# EAGLE design DevKit-V1 (EAGLE 9.6.2)

## Sheet 1 of 5
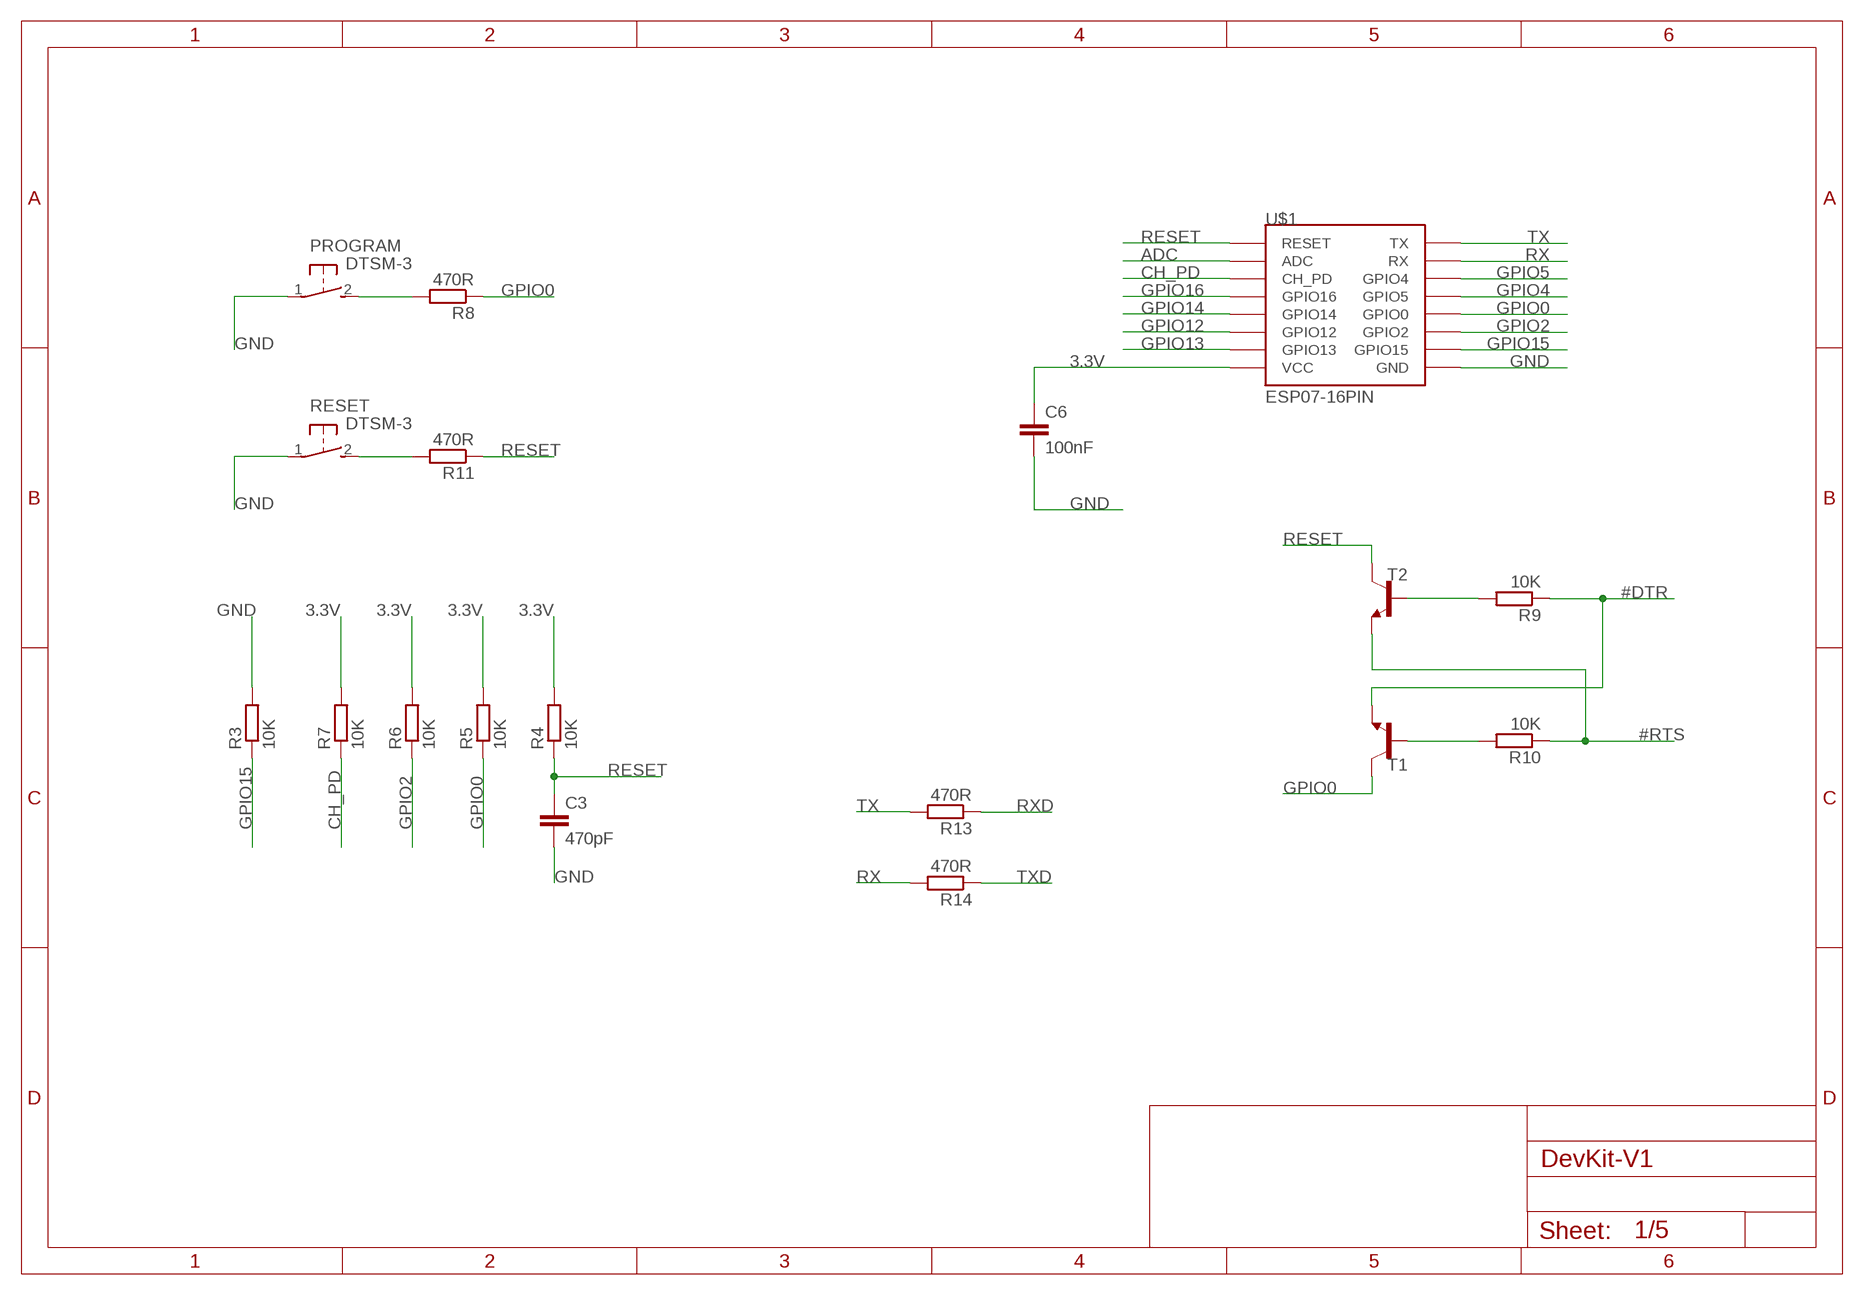
[diagram p0: schematic, sheet 1]

### Parts
C3  470pF  C-EUC0805  [C0805]
C6  100nF  C-EUC0805  [C0805]
PROGRAM  DTSM-3  [DTSM-3]
R3  10K  R-EU_R0805  [R0805]
R4  10K  R-EU_R0805  [R0805]
R5  10K  R-EU_R0805  [R0805]
R6  10K  R-EU_R0805  [R0805]
R7  10K  R-EU_R0805  [R0805]
R8  470R  R-EU_R0805  [R0805]
R9  10K  R-EU_R0805  [R0805]
R10  10K  R-EU_R0805  [R0805]
R11  470R  R-EU_R0805  [R0805]
R13  470R  R-EU_R0805  [R0805]
R14  470R  R-EU_R0805  [R0805]
RESET  DTSM-3  [DTSM-3]
T1  -NPN-SOT23-EBC  [SOT23-EBC]
T2  -NPN-SOT23-EBC  [SOT23-EBC]
U$1  ESP07-16PIN  [ESP07-16PIN]

### Nets
3.3V: C6.1 R4.2 R5.2 R6.2 R7.2 U$1.VCC ; also sheet 2,3,4
#DTR: R9.1 T1.E ; also sheet 2
#RTS: R10.1 T2.E ; also sheet 2
ADC: U$1.ADC
CH_PD: R7.1 U$1.CH_PD
GND: C3.2 C6.2 PROGRAM.1 R3.2 RESET.1 U$1.GND ; also sheet 2,3,4,5
GPIO0: R5.1 R8.1 T1.C U$1.GPIO0
GPIO2: R6.1 U$1.GPIO2
GPIO4: U$1.GPIO5 ; also sheet 5
GPIO5: U$1.GPIO4 ; also sheet 5
GPIO12: U$1.GPIO12 ; also sheet 4
GPIO13: U$1.GPIO13 ; also sheet 4
GPIO14: U$1.GPIO14 ; also sheet 4
GPIO15: R3.1 U$1.GPIO15 ; also sheet 4
GPIO16: U$1.GPIO16
N$1: PROGRAM.2 R8.2
N$2: R11.2 RESET.2
N$8: R10.2 T1.B
N$11: R9.2 T2.B
RESET: C3.1 R4.1 R11.1 T2.C U$1.REST(RESET)
RX: R14.2 U$1.RX
RXD: R13.1 ; also sheet 2
TX: R13.2 U$1.TX
TXD: R14.1 ; also sheet 2

## Sheet 2 of 5
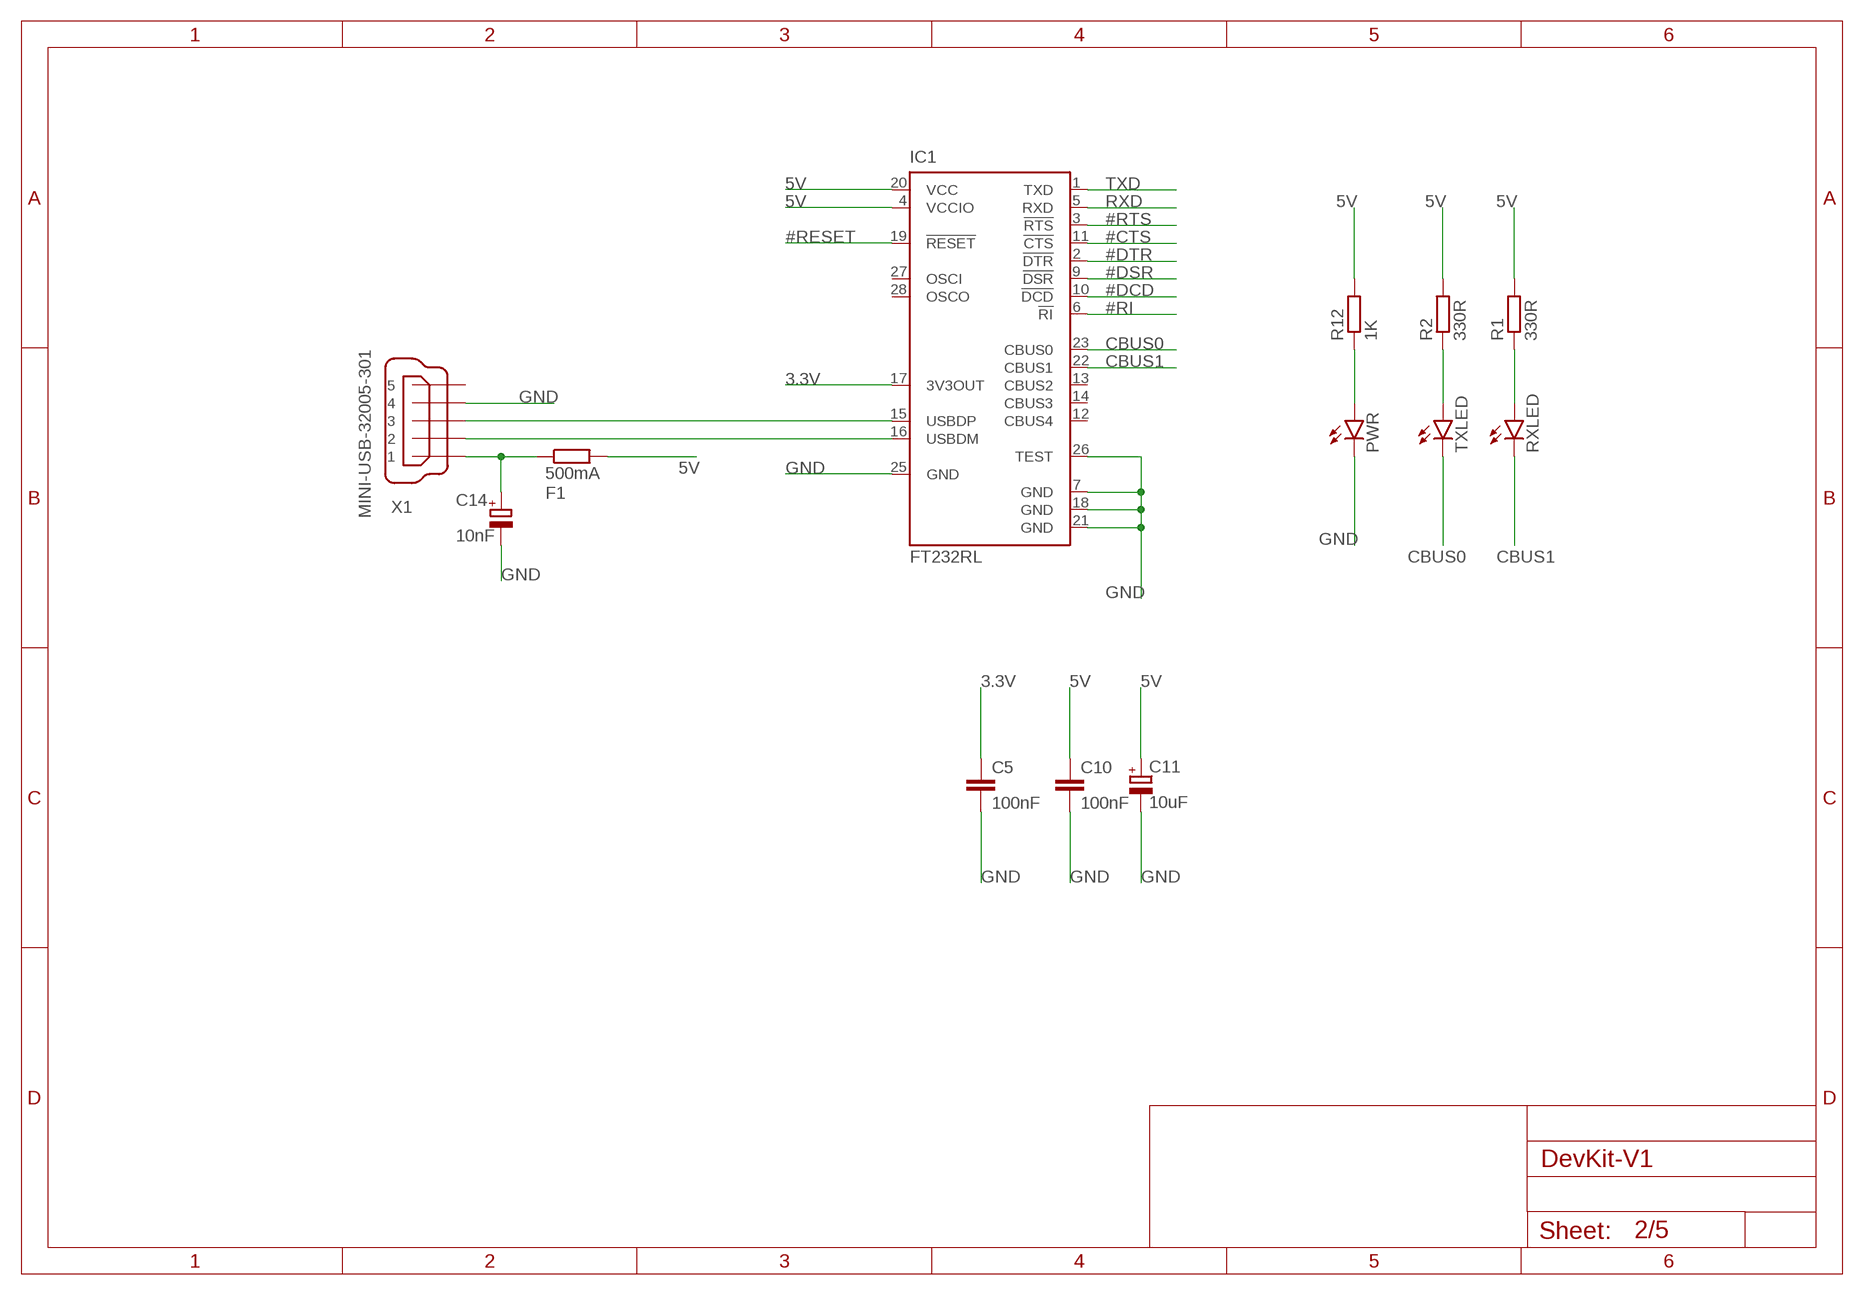
[diagram p1: schematic, sheet 2]

### Parts
C5  100nF  C-EUC0805  [C0805]
C10  100nF  C-EUC0805  [C0805]
C11  10uF  CPOL-EUSMCA  [SMC_A]
C14  10nF  CPOL-EUSMCA  [SMC_A]
F1  500mA  R-EU_R0805  [R0805]
IC1  FT232RL  [SSOP28]
PWR  LEDCHIP-LED0805  [CHIP-LED0805]
R1  330R  R-EU_R0805  [R0805]
R2  330R  R-EU_R0805  [R0805]
R12  1K  R-EU_R0805  [R0805]
RXLED  LEDCHIP-LED0805  [CHIP-LED0805]
TXLED  LEDCHIP-LED0805  [CHIP-LED0805]
X1  MINI-USB-32005-301  [32005-301]

### Nets
3.3V: C5.1 IC1.17(3V3OUT) ; also sheet 1,3,4
5V: C10.1 C11.+ F1.2 IC1.4(VCCIO) IC1.20(VCC) R1.2 R2.2 R12.2 ; also sheet 3,5
#CTS: IC1.11(!CTS)
#DCD: IC1.10(!DCD)
#DSR: IC1.9(!DSR)
#DTR: IC1.2(!DTR) ; also sheet 1
#RESET: IC1.19(!RESET)
#RI: IC1.6(!RI)
#RTS: IC1.3(!RTS) ; also sheet 1
CBUS0: IC1.23(CBUS0) TXLED.C
CBUS1: IC1.22(CBUS1) RXLED.C
GND: C5.2 C10.2 C11.- C14.- IC1.7(GND) IC1.18(GND) IC1.21(GND) IC1.25(GND) IC1.26(TEST) PWR.C X1.4 ; also sheet 1,3,4,5
N$6: IC1.15(USBDP) X1.3
N$7: IC1.16(USBDM) X1.2
N$10: C14.+ F1.1 X1.1
N$15: R1.1 RXLED.A
N$16: R2.1 TXLED.A
N$20: PWR.A R12.1
RXD: IC1.5(RXD) ; also sheet 1
TXD: IC1.1(TXD) ; also sheet 1
Unconnected: IC1.12(CBUS4) IC1.13(CBUS2) IC1.14(CBUS3) IC1.27(OSCI) IC1.28(OSCO) X1.5

## Sheet 3 of 5
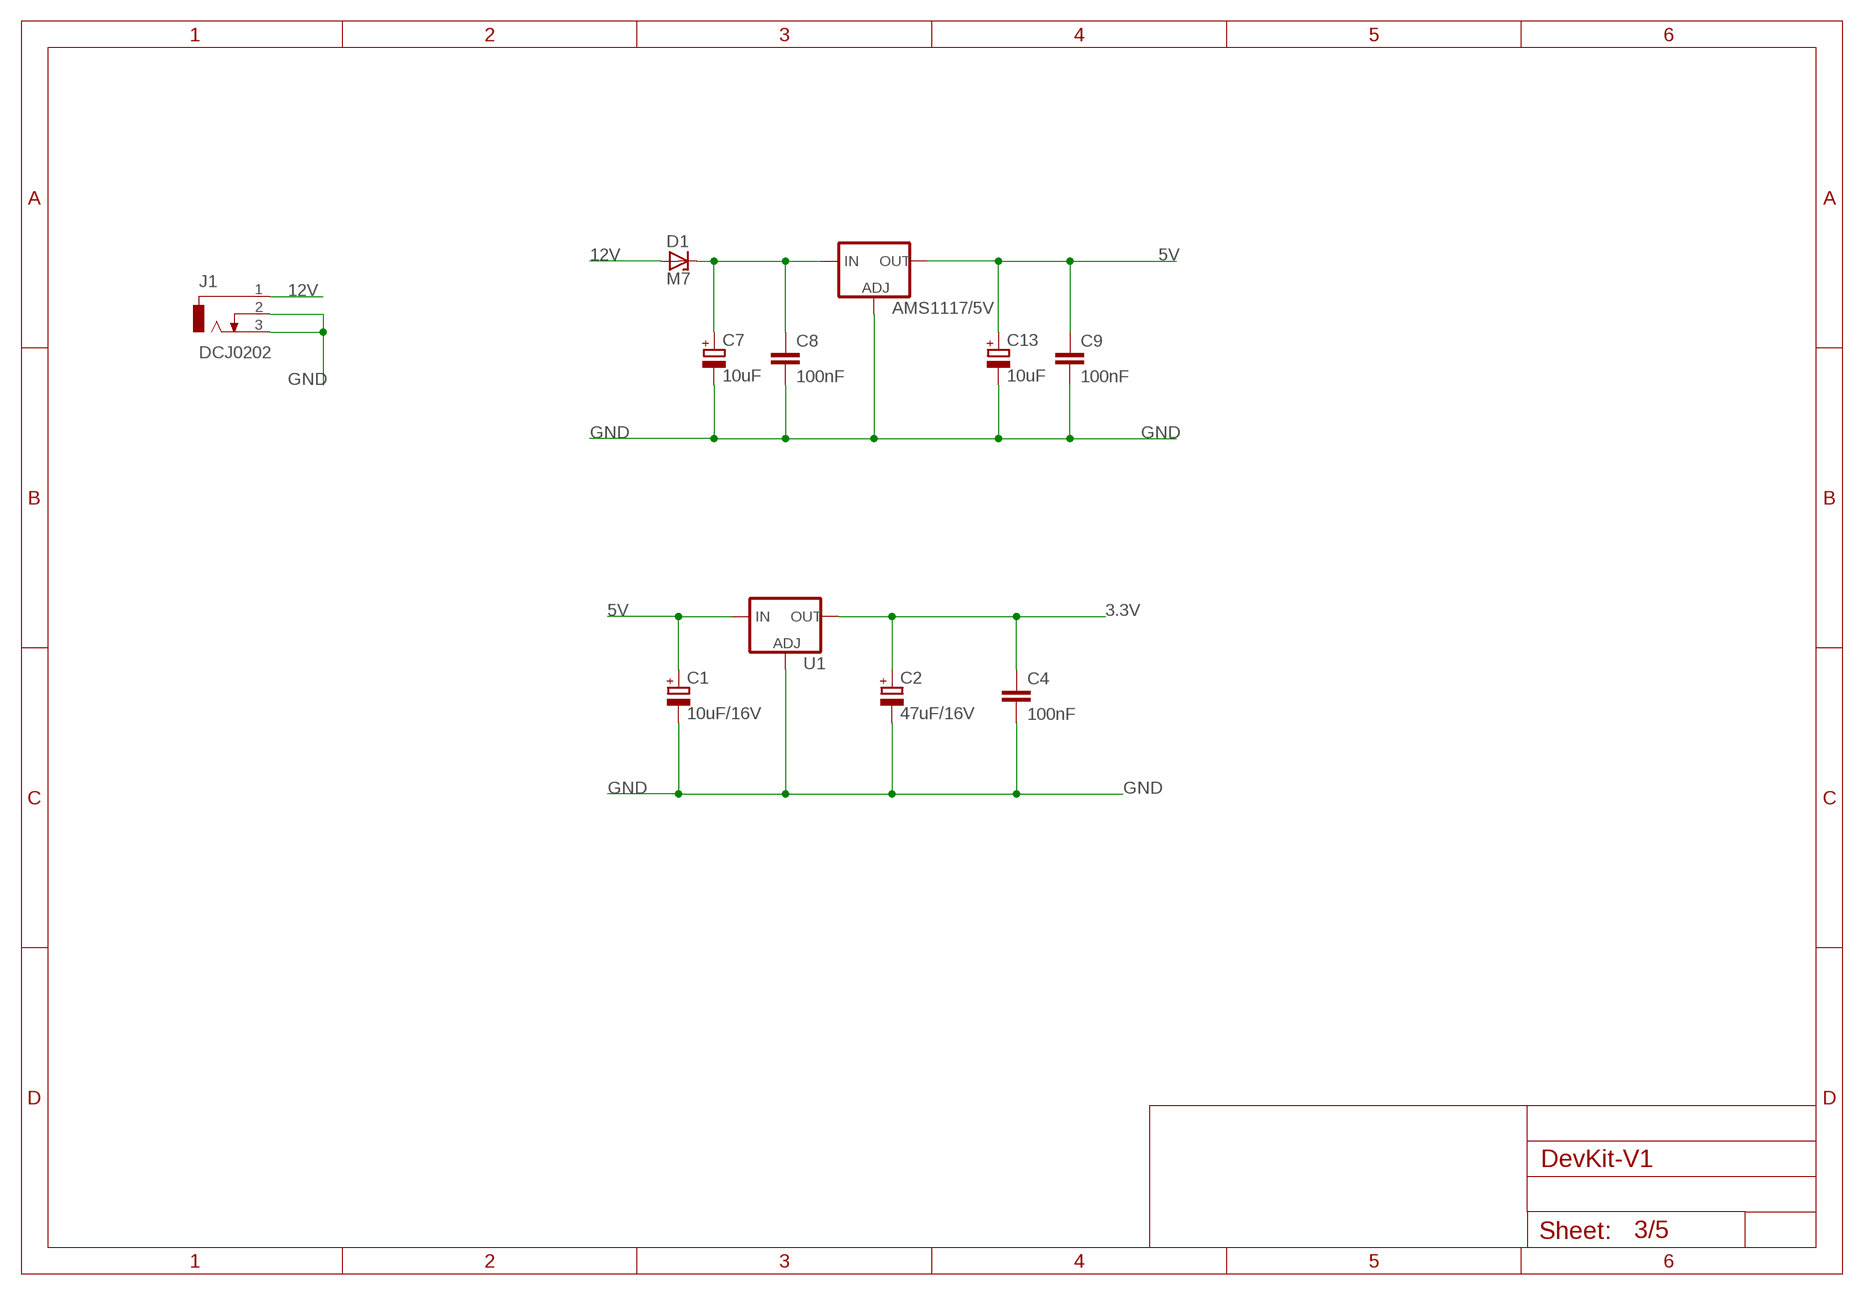
[diagram p2: schematic, sheet 3]

### Parts
AMS1117/5V  V_REG_LM1117SOT223  [SOT223]
C1  10uF/16V  CPOL-EU153CLV-0405  [153CLV-0405]
C2  47uF/16V  CPOL-EU153CLV-0605  [153CLV-0605]
C4  100nF  C-EUC0805  [C0805]
C7  10uF  CPOL-EU153CLV-0405  [153CLV-0405]
C8  100nF  C-EUC0805  [C0805]
C9  100nF  C-EUC0805  [C0805]
C13  10uF  CPOL-EU153CLV-0405  [153CLV-0405]
D1  M7  1SMA5913BT3G  [DO214AC]
J1  DCJ0202  [DCJ0202]
U1  V_REG_LM1117SOT223  [SOT223]

### Nets
3.3V: C2.+ C4.1 U1.2(OUT) U1.4(OUT) ; also sheet 1,2,4
5V: AMS1117/5V.2(OUT) AMS1117/5V.4(OUT) C1.+ C9.1 C13.+ U1.3(IN) ; also sheet 2,5
12V: D1.A J1.1
GND: AMS1117/5V.1(ADJ) C1.- C2.- C4.2 C7.- C8.2 C9.2 C13.- J1.2 J1.3 U1.1(ADJ) ; also sheet 1,2,4,5
N$5: AMS1117/5V.3(IN) C7.+ C8.1 D1.C

## Sheet 4 of 5
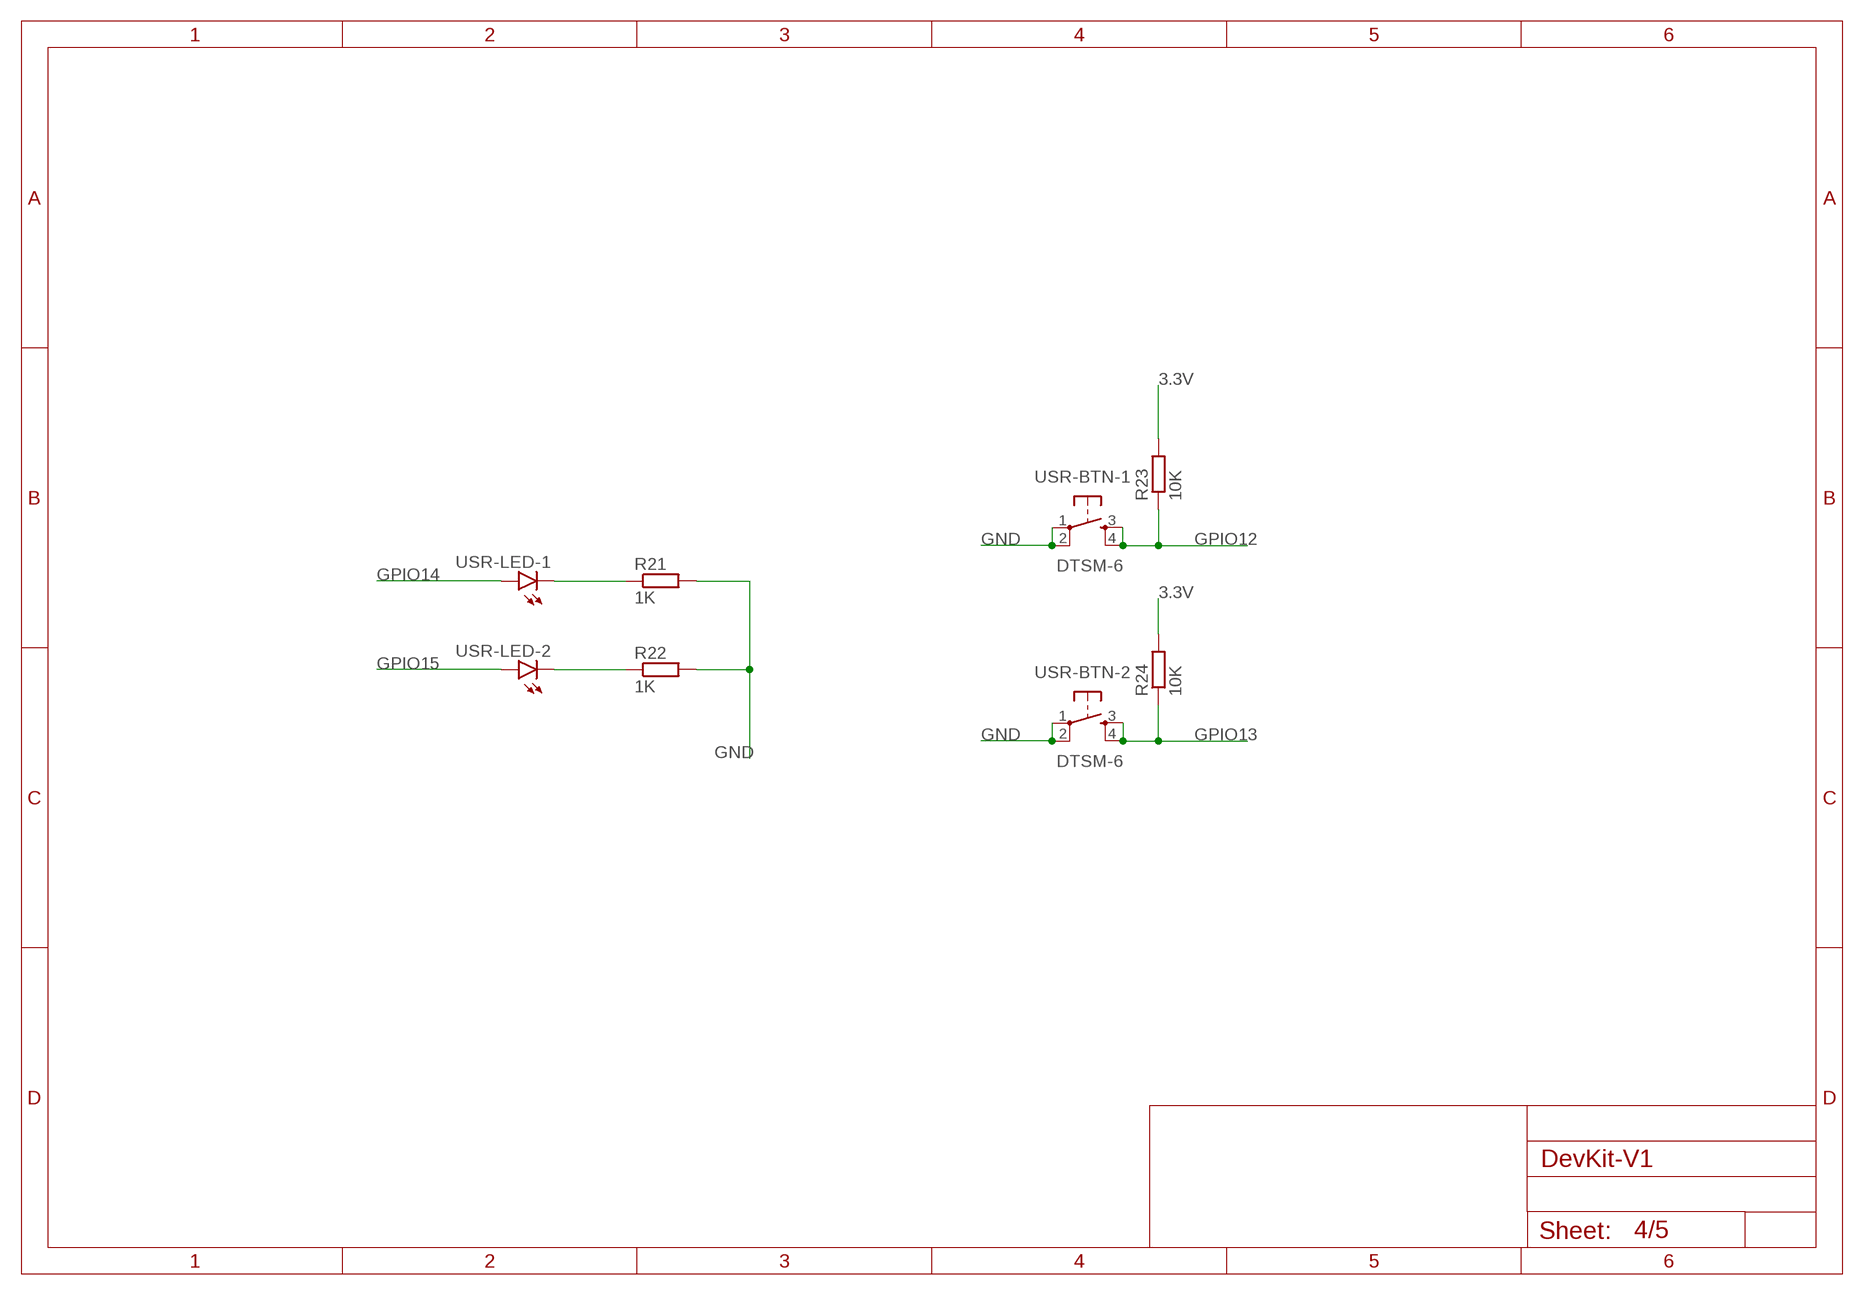
[diagram p3: schematic, sheet 4]

### Parts
R21  1K  R-EU_R0805  [R0805]
R22  1K  R-EU_R0805  [R0805]
R23  10K  R-EU_R0805  [R0805]
R24  10K  R-EU_R0805  [R0805]
USR-BTN-1  DTSM-6  [DTSM-6]
USR-BTN-2  DTSM-6  [DTSM-6]
USR-LED-1  LED5MM  [LED5MM]
USR-LED-2  LED5MM  [LED5MM]

### Nets
3.3V: R23.2 R24.2 ; also sheet 1,2,3
GND: R21.2 R22.2 USR-BTN-1.1 USR-BTN-1.2 USR-BTN-2.1 USR-BTN-2.2 ; also sheet 1,2,3,5
GPIO12: R23.1 USR-BTN-1.3 USR-BTN-1.4 ; also sheet 1
GPIO13: R24.1 USR-BTN-2.3 USR-BTN-2.4 ; also sheet 1
GPIO14: USR-LED-1.A ; also sheet 1
GPIO15: USR-LED-2.A ; also sheet 1
N$12: R21.1 USR-LED-1.K(C)
N$13: R22.1 USR-LED-2.K(C)

## Sheet 5 of 5
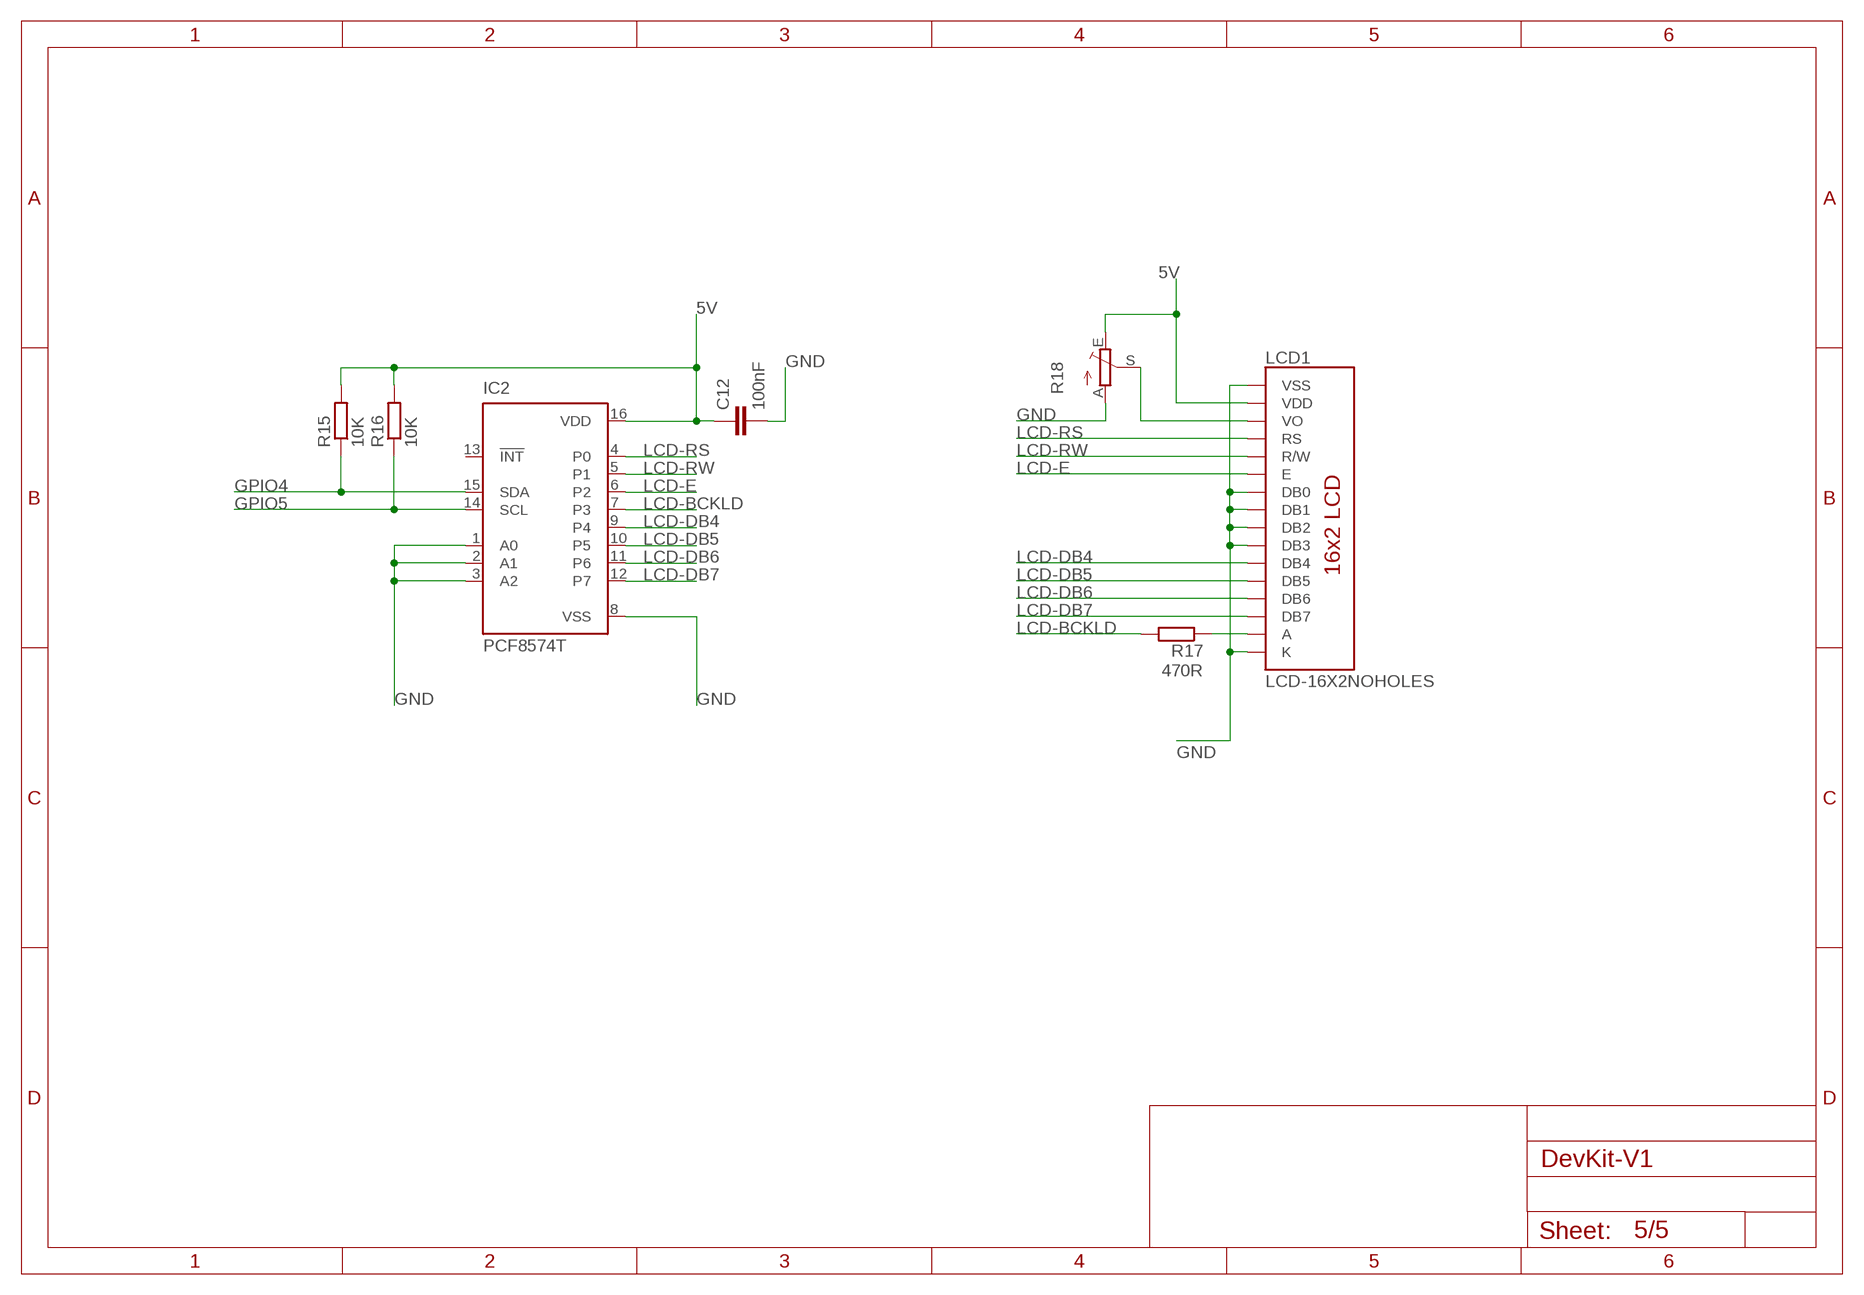
[diagram p4: schematic, sheet 5]

### Parts
C12  100nF  C-EUC0805  [C0805]
IC2  PCF8574T  [SO16W]
LCD1  LCD-16X2NOHOLES  [LCD-16X2_NOHOLESNOSILK]
R15  10K  R-EU_R0805  [R0805]
R16  10K  R-EU_R0805  [R0805]
R17  470R  R-EU_R0805  [R0805]
R18  TRIM_EU-CA6V  [CA6V]

### Nets
5V: C12.1 IC2.16(VDD) LCD1.2(VDD) R15.2 R16.2 R18.E ; also sheet 2,3
GND: C12.2 IC2.1(A0) IC2.2(A1) IC2.3(A2) IC2.8(VSS) LCD1.1(VSS) LCD1.7(DB0) LCD1.8(DB1) LCD1.9(DB2) LCD1.10(DB3) LCD1.16(K) R18.A ; also sheet 1,2,3,4
GPIO4: IC2.15(SDA) R15.1 ; also sheet 1
GPIO5: IC2.14(SCL) R16.1 ; also sheet 1
LCD-BCKLD: IC2.7(P3) R17.2
LCD-DB4: IC2.9(P4) LCD1.11(DB4)
LCD-DB5: IC2.10(P5) LCD1.12(DB5)
LCD-DB6: IC2.11(P6) LCD1.13(DB6)
LCD-DB7: IC2.12(P7) LCD1.14(DB7)
LCD-E: IC2.6(P2) LCD1.6(E)
LCD-RS: IC2.4(P0) LCD1.4(RS)
LCD-RW: IC2.5(P1) LCD1.5(R/W)
N$3: LCD1.15(A) R17.1
N$4: LCD1.3(VO) R18.S
Unconnected: IC2.13(!INT)

## Library data of the parts
AMS1117/5V U1 = SparkFun-IC-Power:V_REG_LM1117: Voltage Regulator LM1117 Standard adjustable voltage regulator but in SMD form. Spark Fun Electronics SKU : COM-00595; PROD_ID: VREG-08170
C1 C2 C7 C11 C13 C14 = rcl:CPOL-EU: POLARIZED CAPACITOR, European symbol; SPICEPREFIX: C
C3-C6 C8-C10 C12 = rcl:C-EU: CAPACITOR, European symbol; SPICEPREFIX: C
D1 = 1sma59xx_10:1SMA59*BT3G: 1SMA59xxBT3G Series 1.5 Watt Plastic Surface Mount Zener Voltage Regulators Source: http://www.onsemi.com/pub_link/Collateral/1SMA5913BT3-D.PDF; MF: ON Semiconductor; MPN: 1SMA5913BT3G; OC_FARNELL: 1431138; OC_NEWARK: 26K5252
F1 R1-R17 R21-R24 = rcl:R-EU_: RESISTOR, European symbol; SPICEPREFIX: R
IC1 = ftdichip:FT232R: Source: http://www.ftdichip.com/Documents/DataSheets/DS_FT232R_v104.pdf; MPN: FT232RL; OC_FARNELL: 1146032; OC_NEWARK: 91K9918
IC2 = micro-philips:PCF8574: I2C-Bus Remote 8-bit I/O expander http://www.semiconductors.philips.com/acrobat_download/datasheets/PCF8574_4.pdf; MPN: PCF8574T/3,512; OC_FARNELL: 1201255; OC_NEWARK: 70R6870
J1 = con-jack:DCJ0202: DC POWER JACK Source: DCJ0202.pdf; OC_FARNELL: unknown; OC_NEWARK: unknown
LCD1 = SparkFun-Displays:LCD-16X2: Standard text-only 16x2 parallel input LCD Basic 16 character by 2 line display. Typically utilizes the extremely common HD44780 parallel interface chipset SparkFun Products: Basic 16x2 Green <https://www.sparkfun.com/products/255> Basic 8x2 Green <https://www.sparkfun.com/products/11122>; SF_ID: LCD-00255
PROGRAM RESET = switch-tact:DTSM-3
PWR RXLED TXLED USR-LED-1 USR-LED-2 = led:LED: LED OSRAM: - CHIPLED LG R971, LG N971, LY N971, LG Q971, LY Q971, LO R971, LY R971 LH N974, LH R974 LS Q976, LO Q976, LY Q976 LO Q996 - Hyper CHIPLED LW Q18S LB Q993, LB Q99A, LB R99A - SideLED LS A670, LO A670, LY A670, LG A670, LP A670 LB A673, LV A673, LT A673, LW A673 LH A674 LY A675 LS A676, LA A676, LO A676, LY A676, LW A676 LS A679, LY A679, LG A679 - Hyper Micro SIDELED® LS Y876, LA Y876, LO Y876, LY Y876 LT Y87S - SmartLED LW L88C, LW L88S LB L89C, LB L89S, LG L890 LS L89K, LO L89K, LY L89K LS L896, LA L896, LO L896, LY L896 - TOPLED LS T670, LO T670, LY T670, LG T670, LP T670 LSG T670, LSP T670, LSY T670, LOP T670, LYG T670 LG T671, LOG T671, LSG T671 LB T673, LV T673, LT T673, LW T673 LH T674 LS T676, LA T676, LO T676, LY T676, LB T676, LH T676, LSB T676, LW T676 LB T67C, LV T67C, LT T67C, LS T67K, LO T67K, LY T67K, LW E67C LS E67B, LA E67B, LO E67B, LY E67B, LB E67C, LV E67C, LT E67C LW T67C LS T679, LY T679, LG T679 LS T770, LO T770, LY T770, LG T770, LP T770 LB T773, LV T773, LT T773, LW T773 LH T774 LS E675, LA E675, LY E675, LS T675 LS T776, LA T776, LO T776, LY T776, LB T776 LHGB T686 LT T68C, LB T68C - Hyper Mini TOPLED® LB M676 - Mini TOPLED Santana® LG M470 LS M47K, LO M47K, LY M47K Source: http://www.osram.convergy.de LUXEON: - LUMILED® LXK2-PW12-R00, LXK2-PW12-S00, LXK2-PW14-U00, LXK2-PW14-V00 LXK2-PM12-R00, LXK2-PM12-S00, LXK2-PM14-U00 LXK2-PE12-Q00, LXK2-PE12-R00, LXK2-PE12-S00, LXK2-PE14-T00, LXK2-PE14-U00 LXK2-PB12-K00, LXK2-PB12-L00, LXK2-PB12-M00, LXK2-PB14-N00, LXK2-PB14-P00, LXK2-PB14-Q00 LXK2-PR12-L00, LXK2-PR12-M00, LXK2-PR14-Q00, LXK2-PR14-R00 LXK2-PD12-Q00, LXK2-PD12-R00, LXK2-PD12-S00 LXK2-PH12-R00, LXK2-PH12-S00 LXK2-PL12-P00, LXK2-PL12-Q00, LXK2-PL12-R00 Source: www.luxeon.com KINGBRIGHT: KA-3528ASYC Source: www.kingbright.com
R18 = pot:TRIM_EU-: POTENTIOMETER
T1 T2 = transistor:*-NPN-: NPN Transistror BF959 corrected 2008.03.06
U$1 = esp8266modules:ESP07-16PIN: ESP8266 Wifi module 07 - 16 pins; DIMENSIONS: 22.0 x 16.0 mm; PINS: 16; PITCH: 0.078" / 2 mm
USR-BTN-1 USR-BTN-2 = switch-tact:DTSM-6
X1 = con-cypressindustries:MINI-USB-: MINI USB-B Conector Source: www.cypressindustries.com; OC_FARNELL: unknown; OC_NEWARK: unknown

## Board
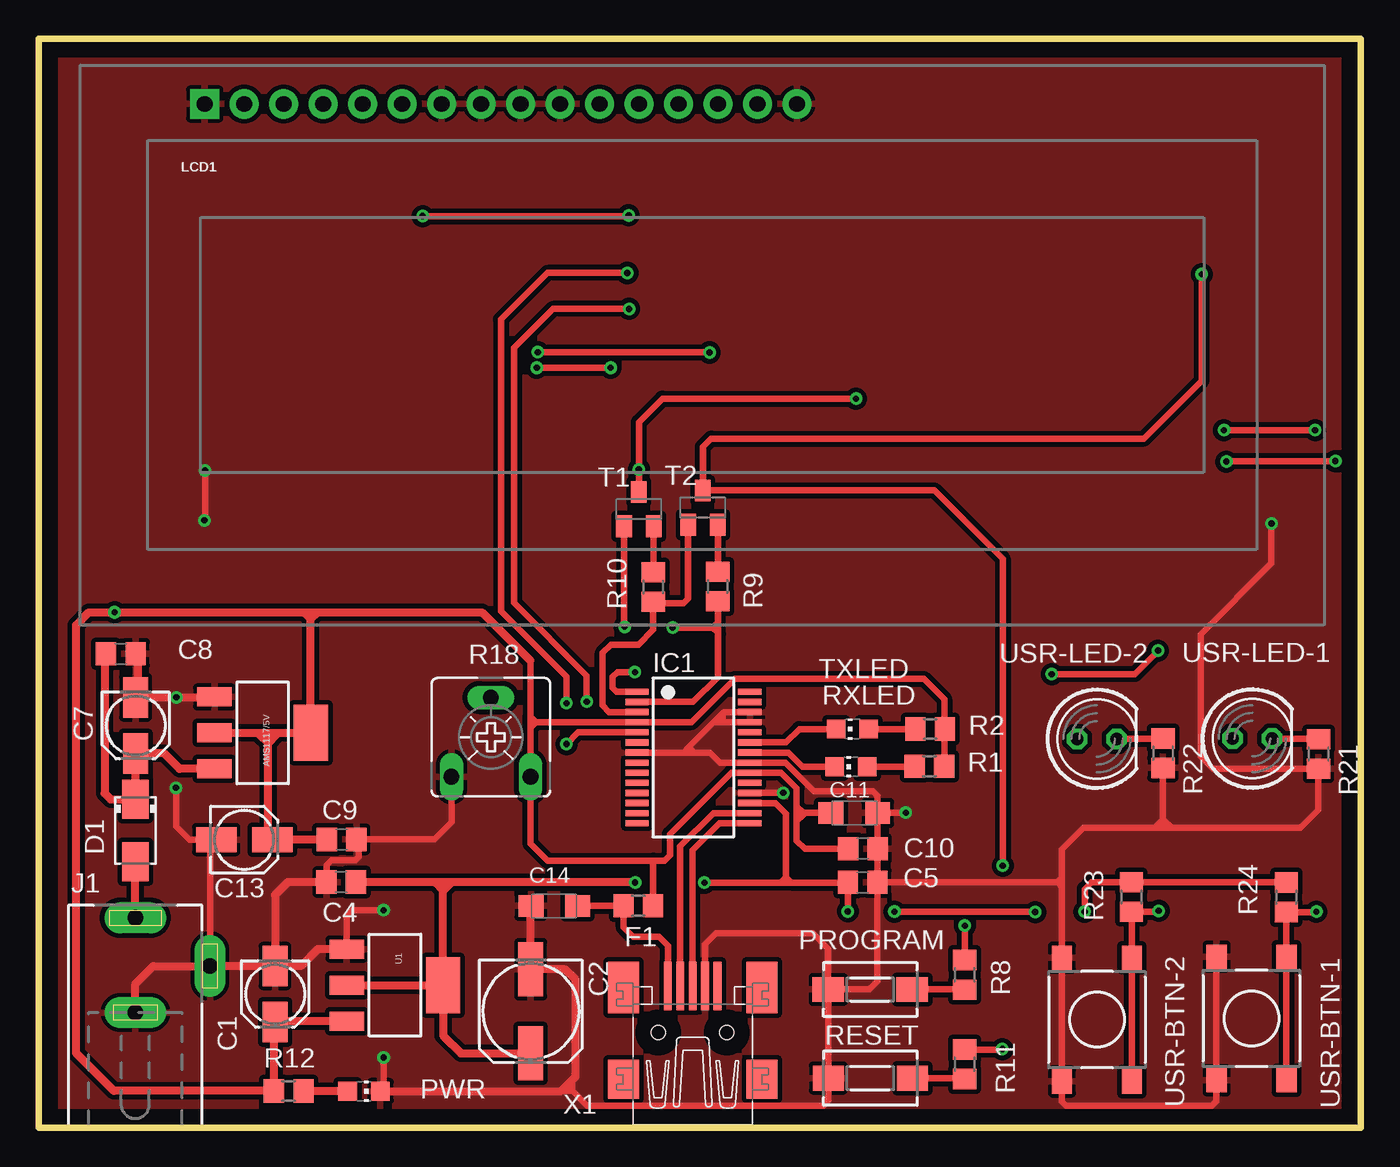
[diagram p5: board, top side]
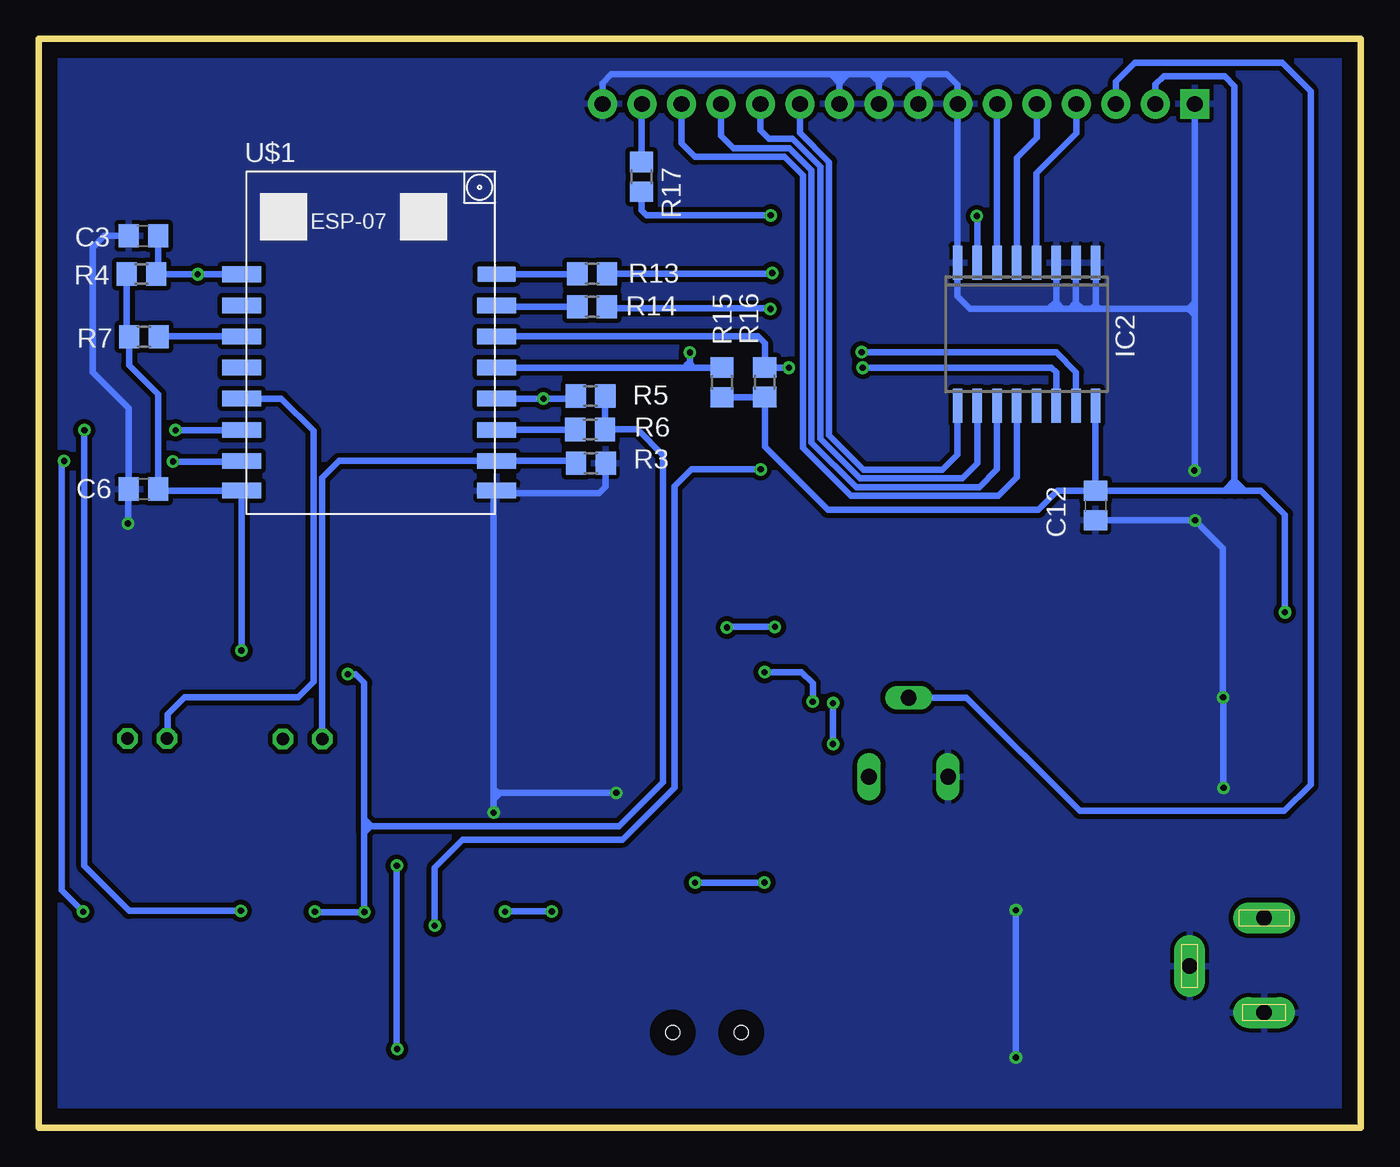
[diagram p6: board, bottom side, seen from below]

Size 85 x 70 mm. Coordinates in mm from the lower left corner, seen from the top.
Outline: 0,0 85,0 85,70 0,70 0,0
Copper layers (1*16): Top 0.035mm / dielectric 1.5mm / Bottom 0.035mm
Design rules "default": minimum track width 6mil, minimum drill 0.35mm, track to track 6mil, track to pad 6mil, pad to pad 6mil, via to via 6mil, smd to smd 6mil, copper to edge 40mil, drill to drill 6mil, minimum pad ring 10mil, minimum via ring 8mil, stop-mask expansion 4mil, vias tented up to drill 0mil, thermal gap 10mil

### Footprints (pad centres in the part's own frame; a part is rotated, then mirrored left to right if it is on the bottom)
SOT223 = smd 1.219 x 2.235: 1 -2.311,-3.099; 2 0,-3.099; 3 2.311,-3.099 | smd 3.6 x 2.2: 4 0,3.099
153CLV-0405 = smd 2.6 x 1.6: + 1.8,0; - -1.8,0
153CLV-0605 = smd 3.5 x 1.6: + 2.7,0; - -2.7,0
C0805 = smd 1.3 x 1.5: 1 -0.95,0; 2 0.95,0
SMC_A = smd 1.6 x 1.4: + -1.5,0; - 1.5,0
DO214AC = smd 2.5 x 1.7: A 2,0; C -2,0
R0805 = smd 1.3 x 1.5: 1 -0.95,0; 2 0.95,0
SSOP28 = smd 0.4 x 1.5: 1 -4.225,-3.625; 2 -3.575,-3.625; 3 -2.925,-3.625; 4 -2.275,-3.625; 5 -1.625,-3.625; 6 -0.975,-3.625; 7 -0.325,-3.625; 8 0.325,-3.625; 9 0.975,-3.625; 10 1.625,-3.625; 11 2.275,-3.625; 12 2.925,-3.625; 13 3.575,-3.625; 14 4.225,-3.625; 15 4.225,3.625; 16 3.575,3.625; 17 2.925,3.625; 18 2.275,3.625; 19 1.625,3.625; 20 0.975,3.625; 21 0.325,3.625; 22 -0.325,3.625; 23 -0.975,3.625; 24 -1.625,3.625; 25 -2.275,3.625; 26 -2.925,3.625; 27 -3.575,3.625; 28 -4.225,3.625
SO16W = smd 0.6 x 2.2: 1 -4.445,-4.6; 2 -3.175,-4.6; 3 -1.905,-4.6; 4 -0.635,-4.6; 5 0.635,-4.6; 6 1.905,-4.6; 7 3.175,-4.6; 8 4.445,-4.6; 9 4.445,4.6; 10 3.175,4.6; 11 1.905,4.6; 12 0.635,4.6; 13 -0.635,4.6; 14 -1.905,4.6; 15 -3.175,4.6; 16 -4.445,4.6
DCJ0202 = drill 1 pad 2 long: 1 0,3.1; 2 4.8,0; 3 0,-3
LCD-16X2_NOHOLESNOSILK = drill 1.016 pad 1.88 square: 1 -32,15.5 | drill 1.016 pad 1.88: 2 -29.46,15.5; 3 -26.92,15.5; 4 -24.38,15.5; 5 -21.84,15.5; 6 -19.3,15.5; 7 -16.76,15.5; 8 -14.22,15.5; 9 -11.68,15.5; 10 -9.14,15.5; 11 -6.6,15.5; 12 -4.06,15.5; 13 -1.52,15.5; 14 1.02,15.5; 15 3.56,15.5; 16 6.1,15.5
DTSM-3 = smd 2 x 1.6: 1 -2.7,0; 2 2.7,0
CHIP-LED0805 = smd 1.2 x 1.2: A 0,-1.05; C 0,1.05
CA6V = drill 1.016 long: A -2.54,-2.54; E 2.54,-2.54; S 0,2.54
SOT23-EBC = smd 1 x 1.4: B 0.95,-1.1; C 0,1.1; E -0.95,-1.1
ESP07-16PIN = smd 2.5 x 1: ADC -8.2,3.8; CH_PD -8.2,1.8; GND 8.2,-8.105; GPIO0 8.2,-2.2; GPIO2 8.2,-4.2; GPIO4 8.2,1.8; GPIO5 8.2,-0.2; GPIO12 -8.2,-4.2; GPIO13 -8.2,-6.2; GPIO14 -8.2,-2.2; GPIO15 8.2,-6.2; GPIO16 -8.2,-0.2; REST -8.2,5.8; RX 8.2,3.8; TX 8.2,5.8; VCC -8.2,-8.105
DTSM-6 = smd 1.55 x 1.3: 1 -3.975,2.25; 2 3.975,2.25; 3 -3.975,-2.25; 4 3.975,-2.25
LED5MM = drill 0.813 octagon: A -1.27,0; K 1.27,0
32005-301 = smd 3.1 x 0.5: 1 3,1.6; 2 3,0.8; 3 3,0; 4 3,-0.8; 5 3,-1.6 | smd 2.5 x 2: M1 -3,-4.45; M2 -3,4.45 | smd 3.3 x 2: M3 2.9,4.45; M4 2.9,-4.45 | hole 0.9: 0,2.2; 0,-2.2

### Placement (x,y rotation side)
AMS1117/5V  14.39,25.39 270 top
C1  15.19,8.6 270 top
C2  31.63,7.49 270 top
C3  78.28,57.34 180 bottom
C4  19.44,15.8 180 top
C5  52.98,15.78 0 top
C6  78.27,41.06 180 bottom
C7  6.22,25.87 270 top
C8  5.27,30.47 0 top
C9  19.47,18.54 0 top
C10  52.99,17.94 0 top
C11  52.44,20.24 0 top
C12  17.05,40 270 bottom
C13  13.21,18.52 0 top
C14  33.14,14.26 180 top
D1  6.22,19.11 270 top
F1  38.55,14.27 0 top
IC1  42.09,23.8 270 top
IC2  21.48,51.01 180 bottom
J1  6.2,10.4 0 top
LCD1  42.66,50.32 0 top
PROGRAM  53.46,8.89 0 top
PWR  20.91,2.35 270 top
R1  57.27,23.24 0 top
R2  57.32,25.64 0 top
R3  49.5,42.72 0 bottom
R4  78.4,54.88 180 bottom
R5  49.52,47.04 0 bottom
R6  49.55,44.89 0 bottom
R7  78.25,50.85 180 bottom
R8  59.54,9.83 270 top
R9  43.66,34.79 90 top
R10  39.51,34.77 90 top
R11  59.54,4.08 270 top
R12  16.07,2.37 180 top
R13  49.42,54.9 180 bottom
R14  49.43,52.78 180 bottom
R15  41.07,47.92 270 bottom
R16  38.32,47.93 270 bottom
R17  46.25,61.13 270 bottom
R18  29.07,25.11 0 top
R21  82.29,24.03 270 top
R22  72.29,24.08 270 top
R23  70.25,14.83 90 top
R24  80.22,14.82 90 top
RESET  53.47,3.19 0 top
RXLED  52.22,23.21 90 top
T1  38.58,39.77 0 top
T2  42.7,39.87 0 top
TXLED  52.32,25.63 90 top
U1  22.9,9.17 270 top
U$1  63.76,49.07 0 bottom
USR-BTN-1  68.05,6.95 90 top
USR-BTN-2  77.98,7.03 90 top
USR-LED-1  78.04,25.02 0 top
USR-LED-2  68.05,25 0 top
X1  42.04,6.12 90 top

### Tracks (layer width: path | path; a pad name or v marks a point on that pad's centre or on a via)
3.3V  (via drill 0.4)
  Top 0.406: 48.05,16.11 48.05,20.19 47.37,20.88 IC1.17 | 48.4,15.76 48.05,16.11 | 48.4,15.76 47.71,15.76 | 48.4,15.76 52.01,15.76 C5.1 v52.03,13.92 v52.02,13.91 | 48.05,16.11 47.71,15.77 47.71,15.76 | R24.2 R23.2 | R23.2 | v55.02,13.89 64.05,13.89 v64.07,13.87 | v67.25,13.89 67.25,15.34 67.68,15.77 R23.2 | v71.97,30.68 71.97,30.64 70.49,29.16 v65.13,29.16 | 47.71,15.76 v42.8,15.76
  Top 0.508: U1.2 U1.4 | 26.48,15.78 26.04,15.78 | 26.04,15.78 25.47,15.78 | 25.47,15.78 20.41,15.78 C4.1 | 26.04,15.78 26,15.74 26,15.25 | U1.4 26,15.25 | 25.47,15.78 26,15.25 | 26,15.25 26.48,15.73 26.48,15.78 | U1.4 26,5.93 27.14,4.79 C2.+ | v38.34,15.77 26.49,15.77 26.48,15.78
  Bottom 0.406: R4.2 79.35,51 R7.2 79.2,49.03 77.32,47.15 C6.1 77.22,40.97 U$1.VCC v71.96,30.69 v71.97,30.68 | R5.2 48.6,47.01 R6.2 46.49,44.89 44.85,43.25 44.85,22.22 47.69,19.38 63.66,19.38 | v52.02,13.91 55,13.91 v55.02,13.89 | v67.25,13.89 67.23,13.87 v64.07,13.87 64.07,18.97 | 64.07,18.97 63.66,19.38 | 64.07,18.97 64.07,19.87 | 64.07,19.87 64.07,28.6 64.63,29.16 v65.13,29.16 | 63.66,19.38 63.66,19.46 64.07,19.87 | v42.8,15.76 v38.35,15.76 v38.34,15.77
5V  (via drill 0.4)
  Top 0.406: F1.2 39.5,17.17 | C10.1 49.25,17.94 48.73,18.46 48.73,19.69 | 48.73,19.69 48.73,20.31 | 48.73,20.31 48.73,20.67 | 48.73,20.67 48.73,21.83 47.73,22.82 IC1.20 44.53,22.82 40.58,18.87 40.58,17.52 40.23,17.17 39.5,17.17 | C11.+ 49.16,20.24 | 49.16,20.24 48.8,20.24 48.73,20.31 | 48.73,20.67 49.16,20.24 | 49.16,20.24 49.16,20.12 48.73,19.69 | 39.5,17.17 32.7,17.17 31.61,18.26 R18.E | R1.2 58.22,25.59 | 58.22,25.59 R2.2 | 58.22,25.59 58.22,27.55 56.91,28.86 44.76,28.86 41.98,26.07 IC1.4 31.96,26.07 | 31.61,30.03 31.61,26.43 | 31.61,26.43 31.61,26.07 | 31.61,26.07 31.61,25.73 | 31.61,22.77 31.61,25.73 | 31.96,26.07 31.61,26.07 | 31.96,26.07 31.61,26.43 | 31.96,26.07 31.61,25.73
  Top 0.508: AMS1117/5V.2 14.18,25.39 | 14.18,25.39 14.73,25.39 | 14.73,25.39 15.33,25.39 | 15.33,25.39 AMS1117/5V.4 17.49,32.71 | 14.73,24.73 14.73,18.8 C13.+ 18.5,18.52 | 14.73,25.39 14.73,24.73 | 14.73,24.73 14.18,25.28 14.18,25.39 | 14.73,24.73 15.33,25.33 15.33,25.39 | U1.3 15.25,6.86 15.12,6.73 R12.2 4.82,2.37 2.39,4.8 2.39,32.31 3.22,33.14 v4.87,33.14 17.06,33.14 | 17.06,33.14 17.49,32.71 | 17.06,33.14 17.92,33.14 | 17.92,33.14 28.5,33.14 31.61,30.03 | 17.49,32.71 17.92,33.14
  Top 0.813: 18.5,18.52 C9.1 | 15.25,6.86 C1.+
  Top 1.27: R18.E 31.61,22.77
  Bottom 0.406: v4.87,33.14 4.87,39.41 6.41,40.95 7.44,40.95 | 7.44,40.95 8.07,40.95 | 8.07,40.95 8.71,40.95 | 8.71,40.95 C12.1 | C12.1 17.05,46.4 IC2.16 | R15.2 R16.2 38.32,43.79 34.26,39.73 20.72,39.73 19.5,40.95 C12.1 | 13.2,65.9 13.2,67.08 12.67,67.61 8.75,67.61 8.11,66.97 8.11,41.62 | 8.07,40.95 8.11,40.99 8.11,41.62 | 8.11,41.62 7.44,40.95 | 8.11,41.62 8.71,41.02 8.71,40.95
  Bottom 1.27: LCD1.2 13.2,65.9
12V
  Top 0.508: 6.2,13.58 6.2,17.09
  Top 0.813: 6.2,17.09 D1.A
  Top 1.27: J1.1 6.2,13.58
#DTR  (via drill 0.4)
  Top 0.406: IC1.2 42.06,27.38 43.66,28.97 43.66,31.66 43.66,31.83 | 43.66,31.83 43.66,32.2 | 43.66,32.2 43.66,32.49 | 43.66,32.49 R9.1 | T1.E 37.63,32.24 v37.67,32.2 | v40.75,32.16 43.33,32.16 | 43.33,32.16 43.62,32.16 43.66,32.2 | 43.66,32.49 43.33,32.16 | 43.33,32.16 43.66,31.83
  Bottom 0.406: v37.67,32.2 40.71,32.2 v40.75,32.16
#RTS
  Top 0.406: IC1.3 36.67,26.73 36.25,27.15 36.25,30.53 36.78,31.06 38.56,31.06 39.51,32.01 39.51,33.71 | 39.51,33.71 R10.1 | T2.E 41.75,34 41.46,33.71 39.51,33.71
CBUS0
  Top 0.406: IC1.23 48.05,24.77 48.91,25.63 TXLED.C
CBUS1
  Top 0.406: IC1.22 48.2,24.12 49.12,23.21 RXLED.C
CH_PD
  Bottom 0.406: U$1.CH_PD 77.28,50.87 R7.1
GND  (via drill 0.4)
  Top 0.406: X1.4 42.84,11.81 43.53,12.5 49.77,12.5 50.76,11.51 PROGRAM.1 | IC1.7 41.45,24.12 | 43.4,26.07 43.97,26.07 | 43.97,26.07 IC1.25 | 41.45,24.12 41.8,24.48 | 41.8,24.48 43.4,26.07 | 42.16,24.12 43.16,24.12 43.8,23.48 IC1.21 48.02,23.48 49.86,21.64 53.65,21.64 53.94,21.35 C11.- | 42.16,24.12 41.45,24.12 | 41.8,24.48 42.16,24.12 | C11.- C10.2 C5.2 | 11,10.61 11,18.11 C13.- 9.69,18.52 8.82,19.39 v8.82,21.85 | C5.2 53.93,9.42 53.4,8.89 PROGRAM.1 | PROGRAM.1 RESET.1 50.78,1.76 50.44,1.42 35.27,1.42 34.31,2.38 | IC1.18 v47.87,21.52 v47.87,21.53 | v55.75,20.26 55.73,20.24 C11.- | IC1.26 44.05,26.73 43.97,26.65 | 43.97,26.65 43.4,26.07 | 43.97,26.07 43.97,26.65 | C4.2 18.49,16.88 18.82,17.21 20.35,17.21 20.57,17.43 20.57,18.39 C9.2 25.44,18.54 26.53,19.63 26.53,22.38 | C5.2 65.49,15.78 | 65.8,15.47 USR-BTN-1.2 USR-BTN-1.1 65.8,1.69 66.06,1.42 75.43,1.42 75.73,1.72 USR-BTN-2.1 USR-BTN-2.2 | 65.49,15.78 65.8,15.47 | 33.96,2.73 34.3,2.4 | 34.31,2.38 34.3,2.4 | 34.3,2.4 34.3,3.06 | 34.31,2.38 33.61,2.38 33.58,2.35 | PWR.C 22.17,2.56 v22.17,4.52 | v22.17,13.99 20.19,13.99 19.8,13.6 U1.1 | 65.8,15.47 65.8,16.09 | 65.8,16.09 65.8,17.91 67.17,19.29 71.73,19.29 | 71.73,19.29 72.34,19.29 | 72.34,19.29 72.85,19.29 | 72.85,19.29 81.12,19.29 82.29,20.46 R21.2 75.5,23.08 74.71,23.87 74.71,31.73 79.27,36.29 v79.27,38.85 | R22.2 72.29,19.85 | 72.29,19.85 72.29,19.34 72.34,19.29 | 65.49,15.78 65.8,16.09 | 72.29,19.85 71.73,19.29 | 72.29,19.85 72.85,19.29 | v10.69,42.25 10.69,39.09 v10.65,39.05
  Top 0.508: AMS1117/5V.1 11.26,27.67 v8.85,27.67 C7.- 6.38,27.83 6.38,30.31 | C4.2 16.01,15.8 15.19,14.98 C1.- | U1.1 17.93,11.48 16.85,10.4 C1.- | C1.- J1.2 7.36,10.4 6.2,9.24 6.2,7.49 | PWR.C 33.58,2.35 33.96,2.73 34.3,3.06 34.5,3.27 34.5,9.54 33.85,10.19 C2.- C14.-
  Top 0.813: C14.- | 6.38,30.31 C8.2
  Top 1.27: R18.A 26.53,22.38 | J1.3 6.2,7.49 | J1.2 11,10.61
  Bottom 0.406: IC2.1 17.04,52.88 | 17.04,52.88 17.27,52.65 | 17.27,52.65 17.91,52.65 | 17.91,52.65 18.37,52.65 | 18.37,52.65 18.71,52.65 | 18.71,52.65 19.17,52.65 | 19.17,52.65 19.62,52.65 | 19.62,52.65 20.07,52.65 | 20.07,52.65 25.12,52.65 25.93,53.45 IC2.8 25.93,65.8 25.93,67.06 26.59,67.72 27.97,67.72 | IC2.2 18.3,53.05 | 18.3,53.05 18.3,52.72 18.37,52.65 | IC2.3 19.57,53.15 | 19.57,53.05 19.57,52.7 19.62,52.65 | 17.27,52.65 16.8,52.65 | 16.8,52.65 11.08,52.65 | 10.66,65.77 10.66,53.07 | 11.08,52.65 10.66,53.07 | 17.04,52.88 16.8,52.65 | 18.3,53.05 | 18.3,53.05 17.91,52.65 | 18.3,53.05 18.71,52.65 | 19.57,53.15 19.57,53.05 | 19.57,53.05 19.17,52.65 | 19.57,53.15 20.07,52.65 | v8.82,21.85 8.82,27.64 v8.85,27.67 8.85,37.25 v10.65,39.05 C12.2 | v47.87,21.53 55.31,21.53 | 55.31,21.53 55.51,21.53 55.75,21.77 | C3.2 80.79,57.34 81.55,56.58 81.55,48.57 79.22,46.24 C6.2 79.27,41.01 v79.27,38.85 | R3.2 48.55,41.2 48.97,40.78 55.38,40.78 55.49,40.89 | 55.49,40.89 U$1.GND | 55.49,40.89 55.75,40.63 55.75,21.77 | 55.75,21.77 55.75,21.09 | 55.75,21.09 v55.75,20.26 | 55.31,21.53 55.75,21.09 | v22.17,4.52 v22.17,13.99 | 48.76,66.05 48.76,67.15 48.19,67.72 34.04,67.72 | 34.04,67.72 33.43,67.72 | 33.43,67.72 33.09,67.72 | 33.09,67.72 31.42,67.72 | 31.42,67.72 30.94,67.72 | 30.94,67.72 30.55,67.72 | 30.55,67.72 28.85,67.72 | 28.85,67.72 28.45,67.72 | 28.45,67.72 27.97,67.72 | 28.44,65.87 28.44,67.25 | 28.44,67.25 28.44,67.71 28.45,67.72 | 30.98,65.92 30.98,67.22 | 30.98,67.22 30.98,67.68 30.94,67.72 | 33.52,65.89 33.52,67.16 | 33.52,67.16 33.52,67.63 33.43,67.72 | 28.44,67.25 27.97,67.72 | 28.44,67.25 28.85,67.66 28.85,67.72 | 30.98,67.22 30.55,67.65 30.55,67.72
  Bottom 0.406: 30.98,67.22 31.42,67.66 31.42,67.72 | 33.52,67.16 33.09,67.59 33.09,67.72 | 33.52,67.16 34.04,67.68 34.04,67.72 | 10.66,53.07 10.66,52.23 | 10.66,52.23 10.66,42.28 v10.69,42.25 | 11.08,52.65 10.66,52.23
  Bottom 1.27: LCD1.1 10.66,65.77 | LCD1.7 25.93,65.8 | LCD1.8 28.44,65.87 | LCD1.9 30.98,65.92 | LCD1.10 33.52,65.89 | LCD1.16 48.76,66.05
  pour Top (isolate 0.305): -4,74 90,74 90,-5 -4,-5
  pour Bottom (isolate 0.305): -7,77 94,77 94,70 94,-9 84,-9 -7,-9
GPIO0  (via drill 0.4)
  Top 0.406: T1.C v38.58,42.33 38.58,45.36 40.09,46.87 v52.55,46.87 | R8.1 v59.54,12.98 v59.55,12.99
  Bottom 0.406: U$1.GPIO0 v52.55,46.87 50.64,46.87 R5.1 | v59.55,12.99 59.55,16.72 57.75,18.52 47.46,18.52 44.12,21.86 44.12,41.23 43.02,42.33 v38.58,42.33
GPIO2
  Bottom 0.406: U$1.GPIO2 50.52,44.87 R6.1
GPIO4  (via drill 0.4)
  Top 0.406: v32.09,49.86 43.11,49.86 v43.13,49.84
  Bottom 0.406: IC2.15 18.3,48.59 19.58,49.86 v32.09,49.86 | v43.13,49.84 43.13,49.11 | 42.89,48.87 R15.1 | 42.89,48.87 43.13,49.11 | 42.89,48.87 43.48,48.87 | 43.48,48.87 U$1.GPIO5 | 43.13,49.11 43.24,49.11 43.48,48.87
GPIO5  (via drill 0.4)
  Top 0.406: v32.02,48.86 v36.77,48.86
  Bottom 0.406: IC2.14 19.57,48.55 19.88,48.86 v32.02,48.86 | v36.77,48.86 38.3,48.86 R16.1 38.32,50.43 38.76,50.87 U$1.GPIO4
GPIO12  (via drill 0.4)
  Top 0.406: USR-BTN-1.3 USR-BTN-1.4 70.3,13.84 R23.1 71.94,13.88 v72.01,13.95 | v82.07,44.85 v76.21,44.85
  Bottom 0.406: v72.01,13.95 79.2,13.95 82.08,16.83 v82.08,44.84 v82.07,44.85 | v76.21,44.85 71.98,44.85 U$1.GPIO12
GPIO13  (via drill 0.4)
  Top 0.406: USR-BTN-2.3 USR-BTN-2.4 80.22,11.01 R24.1 82.13,13.87 v82.15,13.89 | v83.38,42.86 76.4,42.86 v76.37,42.83
  Bottom 0.406: v82.15,13.89 83.54,15.28 83.54,42.7 v83.38,42.86 | v76.37,42.83 72,42.83 U$1.GPIO13
GPIO14
  Bottom 0.406: 76.72,25.06 76.72,26.58 75.64,27.67 68.34,27.67 67.34,28.67 67.34,44.8 69.41,46.87 U$1.GPIO14
  Bottom 1.27: USR-LED-1.A 76.72,25.06
GPIO15
  Bottom 0.406: R3.1 50.6,42.87 U$1.GPIO15 65.7,42.87 66.78,41.79 66.78,25.02
  Bottom 1.27: USR-LED-2.A 66.78,25.02
LCD-BCKLD  (via drill 0.4)
  Top 0.406: v24.68,58.61 37.88,58.61 v37.93,58.66
  Bottom 0.406: IC2.7 24.66,58.59 v24.68,58.61 | v37.93,58.66 45.92,58.66 46.25,58.99 R17.2
LCD-DB4
  Bottom 0.406: IC2.9 25.93,43.27 26.89,42.31 31.98,42.31 34.18,44.51 34.18,62.07 36.06,63.95 36.06,65.76
  Bottom 1.27: LCD1.11 36.06,65.76
LCD-DB5
  Bottom 0.406: IC2.10 24.66,42.71 25.62,41.75 32.21,41.75 34.74,44.28 34.74,61.77 36.55,63.58 38.04,63.58 38.6,64.14 38.6,65.65
  Bottom 1.27: LCD1.12 38.6,65.65
LCD-DB6
  Bottom 0.406: IC2.11 23.39,42.33 24.52,41.19 32.44,41.19 35.3,44.05 35.3,61.54 36.73,62.97 40.33,62.97 41.14,63.78 41.14,65.64
  Bottom 1.27: LCD1.13 41.14,65.64
LCD-DB7
  Bottom 0.406: IC2.12 22.11,41.83 23.31,40.63 32.78,40.63 35.86,43.71 35.86,61.23 37.04,62.41 42.8,62.41 43.68,63.29 43.68,65.61
  Bottom 1.27: LCD1.14 43.68,65.61
LCD-E
  Bottom 0.406: 23.39,65.65 IC2.6
  Bottom 1.27: LCD1.6 23.39,65.8 23.39,65.65
LCD-RS
  Bottom 0.406: IC2.4 20.84,61.38 18.28,63.94 18.28,65.75
  Bottom 1.27: LCD1.4 18.28,65.75
LCD-RW
  Bottom 0.406: IC2.5 22.11,62.34 20.82,63.64 20.82,65.67
  Bottom 1.27: LCD1.5 20.82,65.67
N$1
  Top 0.406: PROGRAM.2 R8.2
N$2
  Top 0.406: RESET.2 59.48,3.19 R11.2
N$3
  Bottom 0.406: 46.25,65.79 R17.1
  Bottom 1.27: LCD1.15 46.25,65.79
N$4
  Bottom 0.406: 28.99,27.65 25.34,27.65 18.06,20.37 4.9,20.37 3.22,22.05 3.22,66.63 5.05,68.46 14.51,68.46 15.74,67.23 15.74,66
  Bottom 1.27: LCD1.3 15.74,66 | R18.S 28.99,27.65
N$5
  Top 0.508: C8.1 4.22,30.37 4.22,21.5 4.61,21.11 D1.C C7.+ 8.05,24.07 9.04,23.08 AMS1117/5V.3
N$6
  Top 0.406: X1.3 42.04,17.85 43.77,19.57 IC1.15
N$7
  Top 0.406: X1.2 41.24,18.08 43.38,20.23 IC1.16
N$8
  Top 0.406: R10.2 39.53,35.74 T1.B
N$10
  Top 0.406: X1.1 40.44,11.72 39.89,12.27 38.22,12.27 37.6,12.89 F1.1 C14.+
N$11
  Top 0.406: R9.2 T2.B
N$12
  Top 0.406: 79.36,25.02 82.25,25.02 R21.1
  Top 1.27: USR-LED-1.K 79.36,25.02
N$13
  Top 0.406: USR-LED-2.K 72.26,25 R22.1
  Top 1.27: USR-LED-2.K
N$15
  Top 0.406: RXLED.A 56.29,23.21 R1.1
N$16
  Top 0.406: TXLED.A R2.1
N$20
  Top 0.508: PWR.A 17.04,2.35
  Top 0.813: 17.04,2.35 R12.1
RESET  (via drill 0.4)
  Top 0.406: v74.78,54.87 74.78,48.03 71.06,44.31 43.23,44.31 42.7,43.78 T2.C 57.58,40.97 61.98,36.57 v61.98,16.85 | v61.96,5.06 61.93,5.03 R11.1
  Bottom 0.406: U$1.REST v74.78,54.87 R4.1 77.33,55 C3.1 | v61.98,16.85 61.98,5.08 v61.96,5.06
RX
  Bottom 0.406: R14.2 55.47,52.78 U$1.RX
RXD  (via drill 0.4)
  Top 0.406: v37.84,54.95 32.7,54.95 29.72,51.97 29.72,33.21 33.93,29 v33.93,27.3 | v33.93,24.67 34.69,25.43 IC1.5
  Bottom 0.406: R13.1 37.89,54.9 v37.84,54.95 | v33.93,27.3 v33.93,24.67
TX
  Bottom 0.406: U$1.TX 50.4,54.87 R13.2
TXD  (via drill 0.4)
  Top 0.406: v37.96,52.64 33.05,52.64 30.55,50.14 30.55,33.75 35.23,29.07 v35.23,27.39 | IC1.1 37.15,28.02 36.89,28.28 36.89,28.98 37.2,29.29 v38.33,29.29
  Bottom 0.406: R14.1 48.39,52.69 38.01,52.69 v37.96,52.64 | v35.23,27.39 35.23,28.57 35.95,29.29 v38.33,29.29